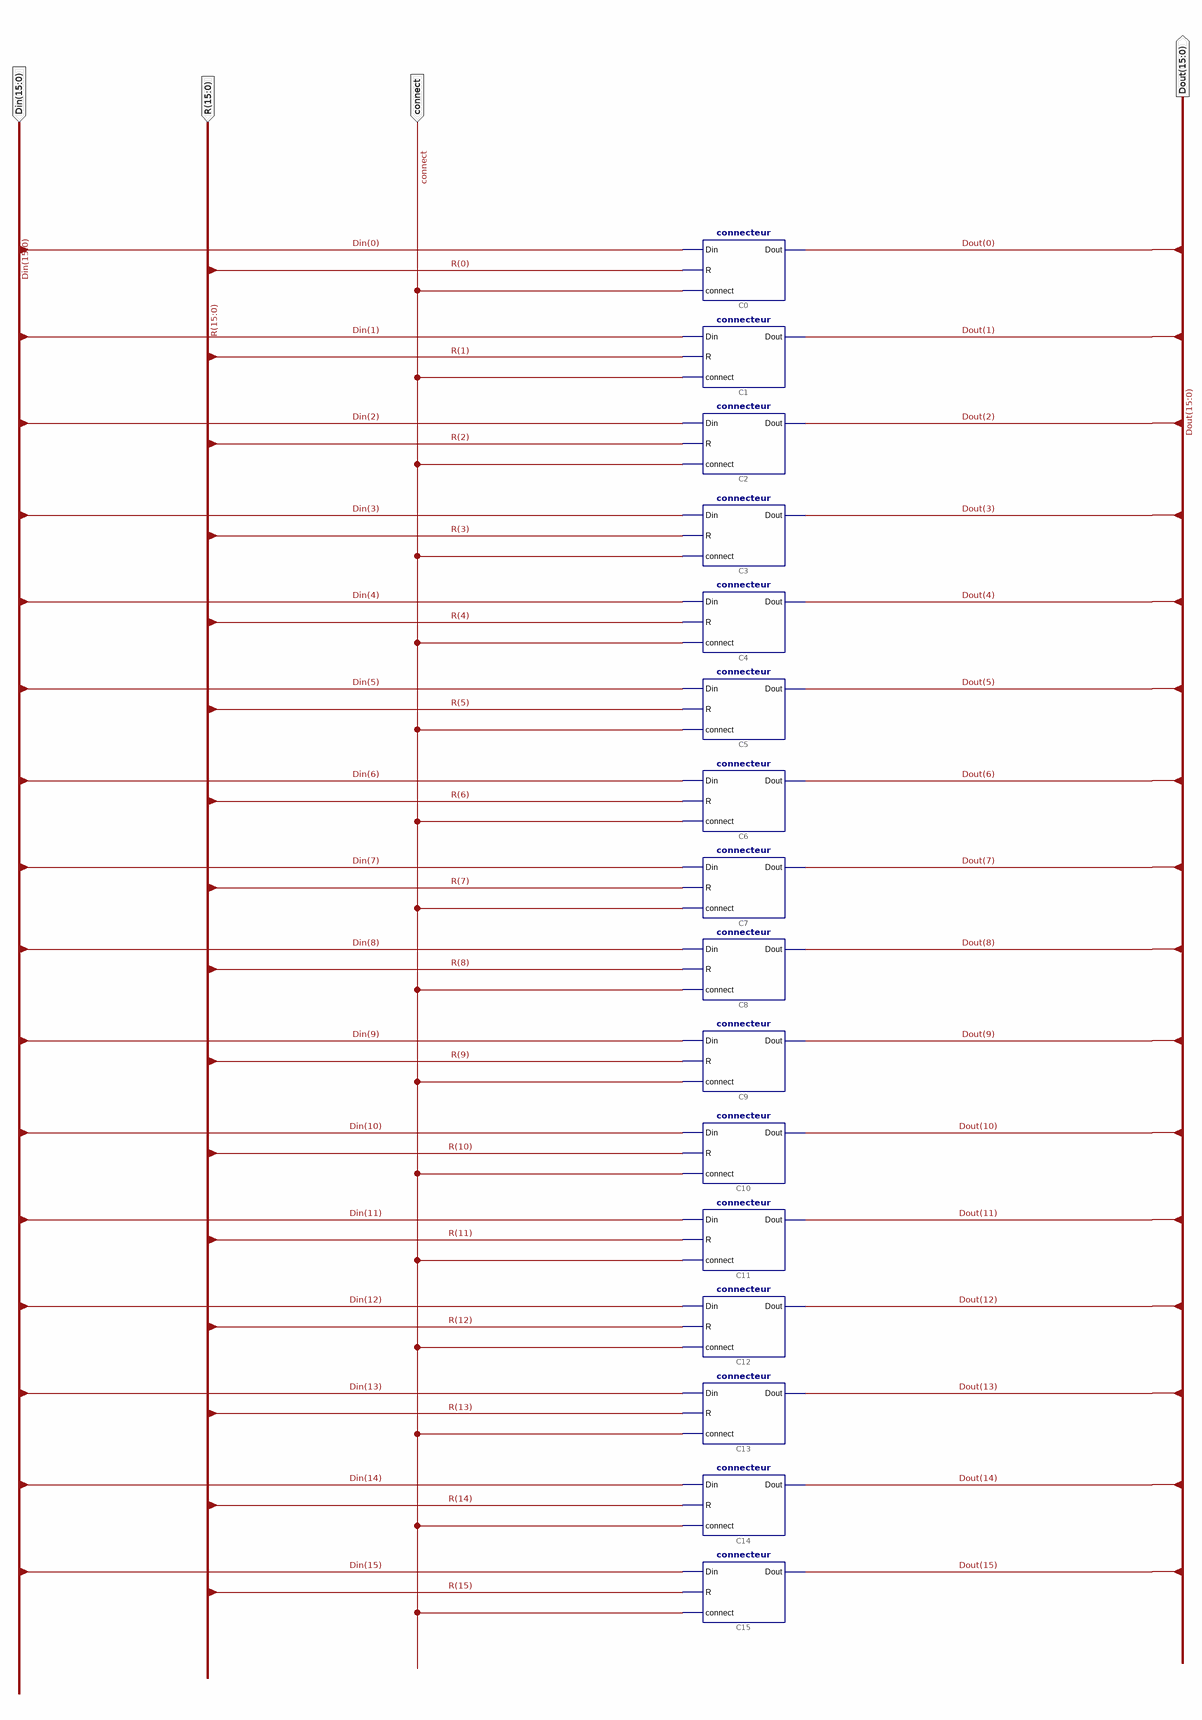
[diagram p0: schematic sheet 1]
// Xilinx ISE schematic connecteur16.sch (spartan3e) as structural Verilog: 16 symbols, 4 ports
module connecteur16 (
  input  connect,
  input  [15:0] Din,
  input  [15:0] R,
  output [15:0] Dout
);

  connecteur C0 (.Din(Din[0]), .R(R[0]), .connect(connect), .Dout(Dout[0]));
  connecteur C1 (.Din(Din[1]), .R(R[1]), .connect(connect), .Dout(Dout[1]));
  connecteur C2 (.Din(Din[2]), .R(R[2]), .connect(connect), .Dout(Dout[2]));
  connecteur C3 (.Din(Din[3]), .R(R[3]), .connect(connect), .Dout(Dout[3]));
  connecteur C4 (.Din(Din[4]), .R(R[4]), .connect(connect), .Dout(Dout[4]));
  connecteur C5 (.Din(Din[5]), .R(R[5]), .connect(connect), .Dout(Dout[5]));
  connecteur C6 (.Din(Din[6]), .R(R[6]), .connect(connect), .Dout(Dout[6]));
  connecteur C7 (.Din(Din[7]), .R(R[7]), .connect(connect), .Dout(Dout[7]));
  connecteur C8 (.Din(Din[8]), .R(R[8]), .connect(connect), .Dout(Dout[8]));
  connecteur C9 (.Din(Din[9]), .R(R[9]), .connect(connect), .Dout(Dout[9]));
  connecteur C10 (.Din(Din[10]), .R(R[10]), .connect(connect), .Dout(Dout[10]));
  connecteur C11 (.Din(Din[11]), .R(R[11]), .connect(connect), .Dout(Dout[11]));
  connecteur C12 (.Din(Din[12]), .R(R[12]), .connect(connect), .Dout(Dout[12]));
  connecteur C13 (.Din(Din[13]), .R(R[13]), .connect(connect), .Dout(Dout[13]));
  connecteur C14 (.Din(Din[14]), .R(R[14]), .connect(connect), .Dout(Dout[14]));
  connecteur C15 (.Din(Din[15]), .R(R[15]), .connect(connect), .Dout(Dout[15]));
endmodule
